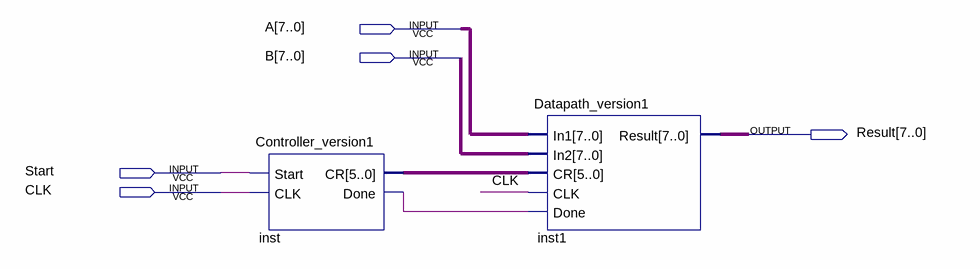
[diagram p0: schematic sheet]
// Quartus schematic vesion1.bdf as structural Verilog: 2 symbols, 5 pins
module vesion1 (
  input  [7:0] A,
  input  [7:0] B,
  input  Start,
  input  CLK,
  output [7:0] Result
);

  wire inst_done;
  wire [5:0] inst_cr;

  Controller_version1 inst (.Start(Start), .CLK(CLK), .CR(inst_cr), .Done(inst_done));
  Datapath_version1 inst1 (.In1(A), .In2(B), .CR(inst_cr), .CLK(CLK), .Done(inst_done), .Result(Result));
endmodule
